# EAGLE schematic LCD-Input_Module (EAGLE 9.6.2)

## Sheet 1 of 2
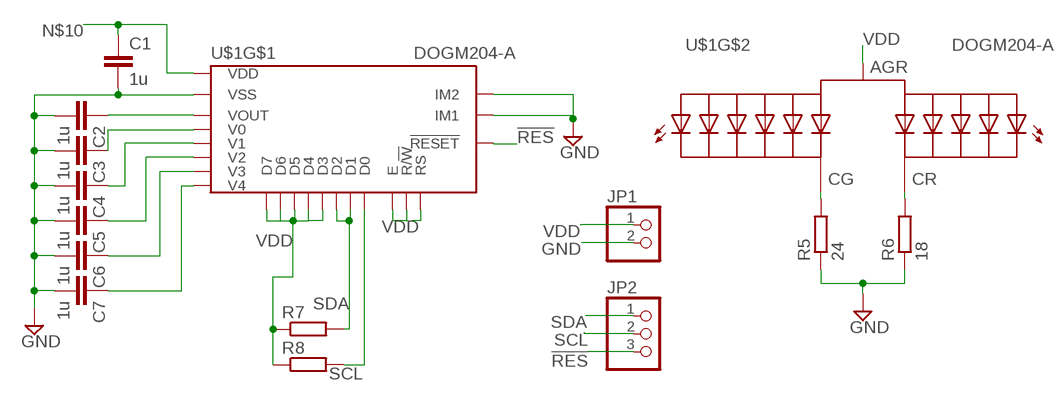
[diagram p0: schematic, sheet 1]

### Parts
C1  1u  C-EUC0603  [C0603]
C2  1u  C-EUC0603  [C0603]
C3  1u  C-EUC0603  [C0603]
C4  1u  C-EUC0603  [C0603]
C5  1u  C-EUC0603  [C0603]
C6  1u  C-EUC0603  [C0603]
C7  1u  C-EUC0603  [C0603]
JP1  PINHD-1X2  [1X02]
JP2  PINHD-1X3  [1X03]
R5  24  R-EU_R0603  [R0603]
R6  18  R-EU_R0603  [R0603]
R7  R-EU_R0603  [R0603]
R8  R-EU_R0603  [R0603]
U$1  DOGM204-A  [LCD]

### Nets
!RES: JP2.3 U$1.P$44(!RESET)
GND: C1.2 C2.2 C3.2 C4.2 C5.2 C6.2 C7.2 JP1.2 R5.1 R6.1 U$1.P$29(IM2) U$1.P$30(IM1) U$1.P$32(VSS) ; also sheet 2
N$4: C3.1 U$1.P$24(V0)
N$5: C6.1 U$1.P$27(V3)
N$6: C4.1 U$1.P$25(V1)
N$7: C5.1 U$1.P$26(V2)
N$9: C7.1 U$1.P$28(V4)
N$10: C1.1 U$1.P$31(VDD)
N$11: C2.1 U$1.P$23(VOUT)
N$15: R5.2 U$1.P$21(CG)
N$19: R6.2 U$1.P$22(CR)
SCL: JP2.2 R8.2 U$1.P$40(D0)
SDA: JP2.1 R7.2 U$1.P$38(D2) U$1.P$39(D1)
VDD: JP1.1 R7.1 R8.1 U$1.P$1(AGR) U$1.P$33(D7) U$1.P$34(D6) U$1.P$35(D5) U$1.P$36(D4) U$1.P$37(D3) U$1.P$41(E) U$1.P$42(R/!W) U$1.P$43(RS) ; also sheet 2

## Sheet 2 of 2
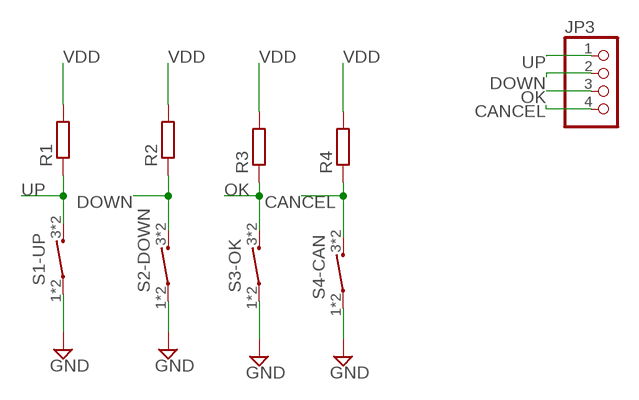
[diagram p1: schematic, sheet 2]

### Parts
JP3  PINHD-1X4  [1X04]
R1  R-EU_R0603  [R0603]
R2  R-EU_R0603  [R0603]
R3  R-EU_R0603  [R0603]
R4  R-EU_R0603  [R0603]
S1-UP  PTS647  [PTS647-TACTSWITCH]
S2-DOWN  PTS647  [PTS647-TACTSWITCH]
S3-OK  PTS647  [PTS647-TACTSWITCH]
S4-CAN  PTS647  [PTS647-TACTSWITCH]

### Nets
CANCEL: JP3.4 R4.1 S4-CAN.3 S4-CAN.4
DOWN: JP3.2 R2.1 S2-DOWN.3 S2-DOWN.4
GND: S1-UP.1 S1-UP.2 S2-DOWN.1 S2-DOWN.2 S3-OK.1 S3-OK.2 S4-CAN.1 S4-CAN.2 ; also sheet 1
OK: JP3.3 R3.1 S3-OK.3 S3-OK.4
UP: JP3.1 R1.1 S1-UP.3 S1-UP.4
VDD: R1.2 R2.2 R3.2 R4.2 ; also sheet 1

## Library data of the parts
C1-C7 = rcl:C-EU: CAPACITOR, European symbol; SPICEPREFIX: C
JP1 = pinhead:PINHD-1X2: PIN HEADER
JP2 = pinhead:PINHD-1X3: PIN HEADER
JP3 = pinhead:PINHD-1X4: PIN HEADER
R1-R8 = rcl:R-EU_: RESISTOR, European symbol; SPICEPREFIX: R
S1-UP S2-DOWN S3-OK S4-CAN = Pump_Component:PTS647: Four terminal ON/OFF mechanical tactil switch Supporting Material: PTS647 Datasheet <https://www.mouser.de/datasheet/2/60/pts647-1841803.pdf>
U$1 = Pump_Component:DOGM204-A